# EAGLE design AS3364 DG412 bus mixer v1.1 (EAGLE 9.6.2)
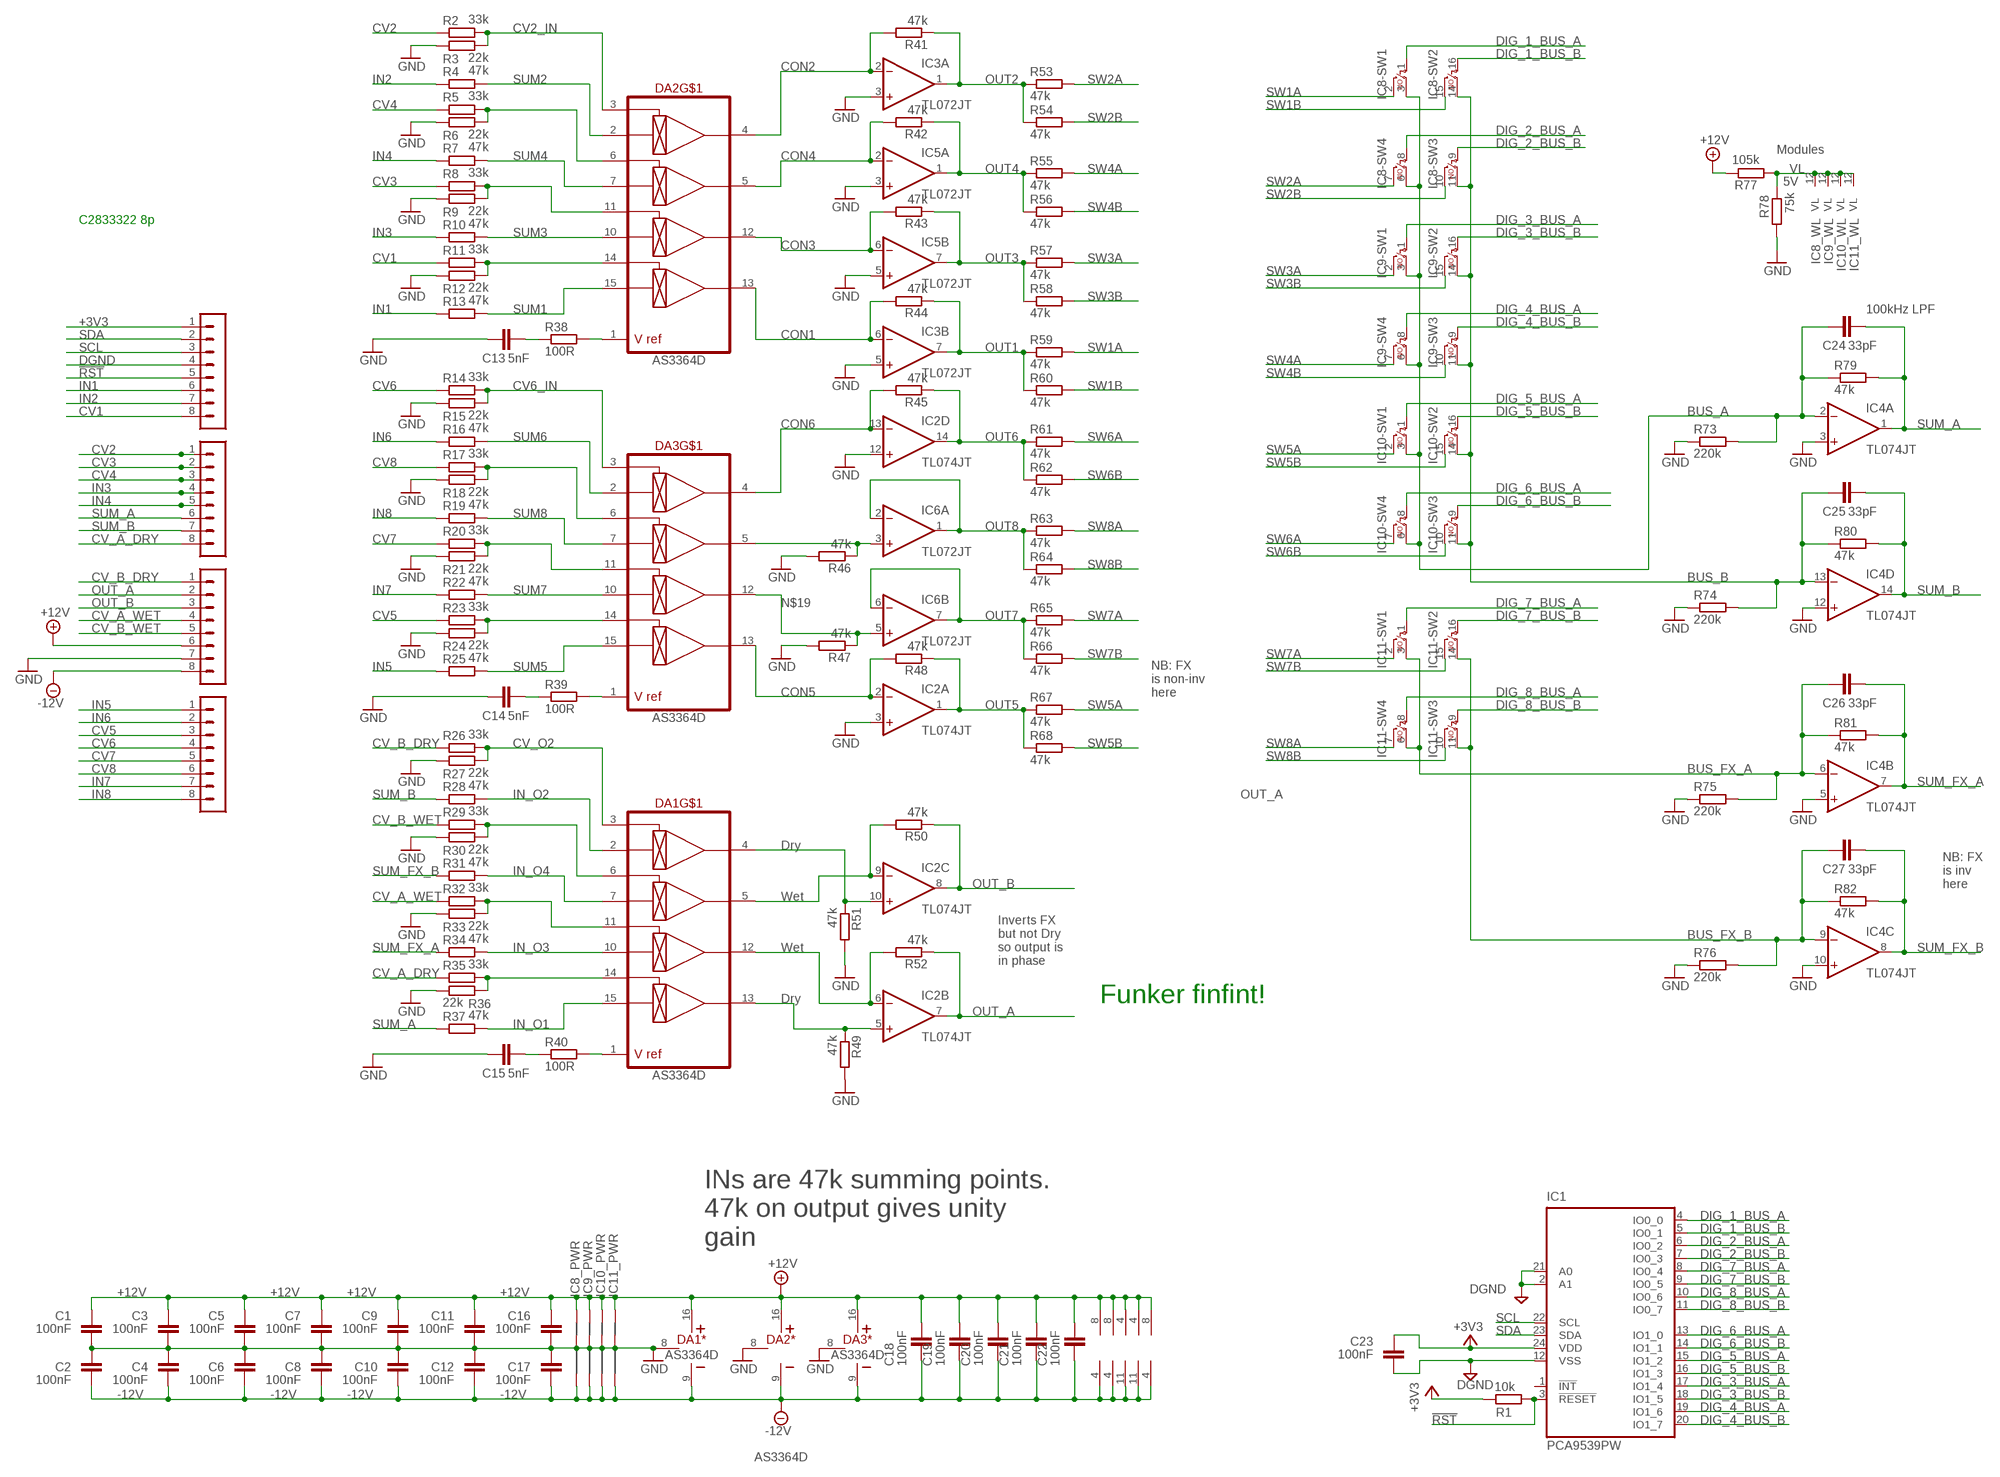
[diagram p0: schematic, sheet 1]

## Parts
C1  100nF  C-EUC0402  [C0402]
C2  100nF  C-EUC0402  [C0402]
C3  100nF  C-EUC0402  [C0402]
C4  100nF  C-EUC0402  [C0402]
C5  100nF  C-EUC0402  [C0402]
C6  100nF  C-EUC0402  [C0402]
C7  100nF  C-EUC0402  [C0402]
C8  100nF  C-EUC0402  [C0402]
C9  100nF  C-EUC0402  [C0402]
C10  100nF  C-EUC0402  [C0402]
C11  100nF  C-EUC0402  [C0402]
C12  100nF  C-EUC0402  [C0402]
C13  5nF  C-EU-J  [C0402-J]
C14  5nF  C-EU-J  [C0402-J]
C15  5nF  C-EU-J  [C0402-J]
C16  100nF  C-EUC0402  [C0402]
C17  100nF  C-EUC0402  [C0402]
C18  100nF  C-EUC0402  [C0402]
C19  100nF  C-EUC0402  [C0402]
C20  100nF  C-EUC0402  [C0402]
C21  100nF  C-EUC0402  [C0402]
C22  100nF  C-EUC0402  [C0402]
C23  100nF  C-EUC0402  [C0402]
C24  33pF  C-EU-J  [C0402-J]
C25  33pF  C-EU-J  [C0402-J]
C26  33pF  C-EU-J  [C0402-J]
C27  33pF  C-EU-J  [C0402-J]
DA1  AS3364D  [DIL16J]
DA2  AS3364D  [DIL16J]
DA3  AS3364D  [DIL16J]
IC1  PCA9539PW  [TSSOP24J]
IC2  TL074JT  [TSSOP14J]
IC3  TL072JT  [TSSOP8J]
IC4  TL074JT  [TSSOP14J]
IC5  TL072JT  [TSSOP8J]
IC6  TL072JT  [TSSOP8J]
IC8  DG412-J  [DIL16J]
IC9  DG412-J  [DIL16J]
IC10  DG412-J  [DIL16J]
IC11  DG412-J  [DIL16J]
R1  10k  R-EU_R0402  [R0402]
R2  33k  R-EU_R0402  [R0402]
R3  22k  R-EU_R0402  [R0402]
R4  47k  R-EU_R0402  [R0402]
R5  33k  R-EU_R0402  [R0402]
R6  22k  R-EU_R0402  [R0402]
R7  47k  R-EU_R0402  [R0402]
R8  33k  R-EU_R0402  [R0402]
R9  22k  R-EU_R0402  [R0402]
R10  47k  R-EU_R0402  [R0402]
R11  33k  R-EU_R0402  [R0402]
R12  22k  R-EU_R0402  [R0402]
R13  47k  R-EU_R0402  [R0402]
R14  33k  R-EU_R0402  [R0402]
R15  22k  R-EU_R0402  [R0402]
R16  47k  R-EU_R0402  [R0402]
R17  33k  R-EU_R0402  [R0402]
R18  22k  R-EU_R0402  [R0402]
R19  47k  R-EU_R0402  [R0402]
R20  33k  R-EU_R0402  [R0402]
R21  22k  R-EU_R0402  [R0402]
R22  47k  R-EU_R0402  [R0402]
R23  33k  R-EU_R0402  [R0402]
R24  22k  R-EU_R0402  [R0402]
R25  47k  R-EU_R0402  [R0402]
R26  33k  R-EU_R0402  [R0402]
R27  22k  R-EU_R0402  [R0402]
R28  47k  R-EU_R0402  [R0402]
R29  33k  R-EU_R0402  [R0402]
R30  22k  R-EU_R0402  [R0402]
R31  47k  R-EU_R0402  [R0402]
R32  33k  R-EU_R0402  [R0402]
R33  22k  R-EU_R0402  [R0402]
R34  47k  R-EU_R0402  [R0402]
R35  33k  R-EU_R0402  [R0402]
R36  22k  R-EU_R0402  [R0402]
R37  47k  R-EU_R0402  [R0402]
R38  100R  R-EU_R0402  [R0402]
R39  100R  R-EU_R0402  [R0402]
R40  100R  R-EU_R0402  [R0402]
R41  47k  R-EU_R0402  [R0402]
R42  47k  R-EU_R0402  [R0402]
R43  47k  R-EU_R0402  [R0402]
R44  47k  R-EU_R0402  [R0402]
R45  47k  R-EU_R0402  [R0402]
R46  47k  R-EU_R0402  [R0402]
R47  47k  R-EU_R0402  [R0402]
R48  47k  R-EU_R0402  [R0402]
R49  47k  R-EU_R0402  [R0402]
R50  47k  R-EU_R0402  [R0402]
R51  47k  R-EU_R0402  [R0402]
R52  47k  R-EU_R0402  [R0402]
R53  47k  R-EU_R0402  [R0402]
R54  47k  R-EU_R0402  [R0402]
R55  47k  R-EU_R0402  [R0402]
R56  47k  R-EU_R0402  [R0402]
R57  47k  R-EU_R0402  [R0402]
R58  47k  R-EU_R0402  [R0402]
R59  47k  R-EU_R0402  [R0402]
R60  47k  R-EU_R0402  [R0402]
R61  47k  R-EU_R0402  [R0402]
R62  47k  R-EU_R0402  [R0402]
R63  47k  R-EU_R0402  [R0402]
R64  47k  R-EU_R0402  [R0402]
R65  47k  R-EU_R0402  [R0402]
R66  47k  R-EU_R0402  [R0402]
R67  47k  R-EU_R0402  [R0402]
R68  47k  R-EU_R0402  [R0402]
R73  220k  R-EU_R0402  [R0402]
R74  220k  R-EU_R0402  [R0402]
R75  220k  R-EU_R0402  [R0402]
R76  220k  R-EU_R0402  [R0402]
R77  105k  R-EU_R0402  [R0402]
R78  75k  R-EU_R0402  [R0402]
R79  47k  R-EU_R0402  [R0402]
R80  47k  R-EU_R0402  [R0402]
R81  47k  R-EU_R0402  [R0402]
R82  47k  R-EU_R0402  [R0402]
SV1  MA08-1JP  [SIP-PIN08-1J]
SV3  MA08-1JP  [SIP-PIN08-1J]
SV4  MA08-1JP  [SIP-PIN08-1J]
SV33  MA08-1JP  [SIP-PIN08-1J]

## Nets
!RST: IC1.3(!RESET) R1.2 SV33.5
+3V3: C23.2 IC1.24(VDD) R1.1 SV33.1
+12V: C1.2 C3.2 C5.2 C7.2 C9.2 C11.2 C16.2 C18.2 C19.2 C20.2 C21.2 C22.2 DA1.16(*:V+) DA2.16(*:V+) DA3.16(*:V+) IC2.4(P:V+) IC3.8(P:V+) IC4.4(P:V+) IC5.8(P:V+) IC6.8(P:V+) IC8.13(_PWR:+15V) IC9.13(_PWR:+15V) IC10.13(_PWR:+15V) IC11.13(_PWR:+15V) R77.1 SV4.6
-12V: C2.1 C4.1 C6.1 C8.1 C10.1 C12.1 C17.1 C18.1 C19.1 C20.1 C21.1 C22.1 DA1.9(*:V-) DA2.9(*:V-) DA3.9(*:V-) IC2.11(P:V-) IC3.4(P:V-) IC4.11(P:V-) IC5.4(P:V-) IC6.4(P:V-) IC8.4(_PWR:-15V) IC9.4(_PWR:-15V) IC10.4(_PWR:-15V) IC11.4(_PWR:-15V) SV4.8
BUS_A: C24.1 IC4.2(A:-IN) IC8.3(-SW1:S) IC8.6(-SW4:S) IC9.3(-SW1:S) IC9.6(-SW4:S) IC10.3(-SW1:S) IC10.6(-SW4:S) R73.2 R79.1
BUS_B: C25.1 IC4.13(D:-IN) IC8.11(-SW3:S) IC8.14(-SW2:S) IC9.11(-SW3:S) IC9.14(-SW2:S) IC10.11(-SW3:S) IC10.14(-SW2:S) R74.2 R80.1
BUS_FX_A: C26.1 IC4.6(B:-IN) IC11.3(-SW1:S) IC11.6(-SW4:S) R75.2 R81.1
BUS_FX_B: C27.1 IC4.9(C:-IN) IC11.11(-SW3:S) IC11.14(-SW2:S) R76.2 R82.1
CON1: DA2.13(OUT4) IC3.6(B:-IN) R44.2
CON2: DA2.4(OUT1) IC3.2(A:-IN) R41.2
CON3: DA2.12(OUT3) IC5.6(B:-IN) R43.2
CON4: DA2.5(OUT2) IC5.2(A:-IN) R42.2
CON5: DA3.13(OUT4) IC2.2(A:-IN) R48.2
CON6: DA3.4(OUT1) IC2.13(D:-IN) R45.2
CON_O1: DA1.12(OUT3) IC2.6(B:-IN) R52.2
CV1: R11.1 SV33.8
CV2: R2.1 SV1.1
CV2_IN: DA2.3(CV1) R2.2 R3.2
CV3: R8.1 SV1.2
CV4: R5.1 SV1.3
CV5: R23.1 SV3.3
CV6: R14.1 SV3.4
CV6_IN: DA3.3(CV1) R14.2 R15.2
CV7: R20.1 SV3.5
CV8: R17.1 SV3.6
CV_A_DRY: R35.1 SV1.8
CV_A_WET: R32.1 SV4.4
CV_B_DRY: R26.1 SV4.1
CV_B_WET: R29.1 SV4.5
CV_O2: DA1.3(CV1) R26.2 R27.2
DGND: C23.1 IC1.2(A1) IC1.12(VSS) IC1.21(A0) SV33.4
DIG_1_BUS_A: IC1.4(IO0_0) IC8.1(-SW1:C)
DIG_1_BUS_B: IC1.5(IO0_1) IC8.16(-SW2:C)
DIG_2_BUS_A: IC1.6(IO0_2) IC8.8(-SW4:C)
DIG_2_BUS_B: IC1.7(IO0_3) IC8.9(-SW3:C)
DIG_3_BUS_A: IC1.17(IO1_4) IC9.1(-SW1:C)
DIG_3_BUS_B: IC1.18(IO1_5) IC9.16(-SW2:C)
DIG_4_BUS_A: IC1.19(IO1_6) IC9.8(-SW4:C)
DIG_4_BUS_B: IC1.20(IO1_7) IC9.9(-SW3:C)
DIG_5_BUS_A: IC1.15(IO1_2) IC10.1(-SW1:C)
DIG_5_BUS_B: IC1.16(IO1_3) IC10.16(-SW2:C)
DIG_6_BUS_A: IC1.13(IO1_0) IC10.8(-SW4:C)
DIG_6_BUS_B: IC1.14(IO1_1) IC10.9(-SW3:C)
DIG_7_BUS_A: IC1.8(IO0_4) IC11.1(-SW1:C)
DIG_7_BUS_B: IC1.9(IO0_5) IC11.16(-SW2:C)
DIG_8_BUS_A: IC1.10(IO0_6) IC11.8(-SW4:C)
DIG_8_BUS_B: IC1.11(IO0_7) IC11.9(-SW3:C)
GND: C1.1 C2.2 C3.1 C4.2 C5.1 C6.2 C7.1 C8.2 C9.1 C10.2 C11.1 C12.2 C13.1 C14.1 C15.1 C16.1 C17.2 DA1.8(*:GND) DA2.8(*:GND) DA3.8(*:GND) IC2.3(A:+IN) IC2.12(D:+IN) IC3.3(A:+IN) IC3.5(B:+IN) IC4.3(A:+IN) IC4.5(B:+IN) IC4.10(C:+IN) IC4.12(D:+IN) IC5.3(A:+IN) IC5.5(B:+IN) IC8.5(_PWR:AGND) IC9.5(_PWR:AGND) IC10.5(_PWR:AGND) IC11.5(_PWR:AGND) R3.1 R6.1 R9.1 R12.1 R15.1 R18.1 R21.1 R24.1 R27.1 R30.1 R33.1 R36.1 R46.2 R47.2 R49.2 R51.2 R73.1 R74.1 R75.1 R76.1 R78.2 SV4.7
IN1: R13.1 SV33.6
IN2: R4.1 SV33.7
IN3: R10.1 SV1.4
IN4: R7.1 SV1.5
IN5: R25.1 SV3.1
IN6: R16.1 SV3.2
IN7: R22.1 SV3.7
IN8: R19.1 SV3.8
IN_O1: DA1.15(IN4) R37.2
IN_O2: DA1.2(IN1) R28.2
IN_O3: DA1.10(IN3) R34.2
IN_O4: DA1.7(IN2) R31.2
N$1: DA3.1(VREF) R39.2
N$2: DA2.1(VREF) R38.2
N$3: DA3.6(CV2) R17.2 R18.2
N$4: DA3.5(OUT2) IC6.3(A:+IN) R46.1
N$5: DA3.11(CV3) R20.2 R21.2
N$6: DA1.5(OUT2) IC2.9(C:-IN) R50.2
N$7: DA3.14(CV4) R23.2 R24.2
N$8: C14.2 R39.1
N$9: DA1.1(VREF) R40.2
N$10: DA2.6(CV2) R5.2 R6.2
N$11: DA1.6(CV2) R29.2 R30.2
N$12: DA2.11(CV3) R8.2 R9.2
N$13: DA1.11(CV3) R32.2 R33.2
N$14: C13.2 R38.1
N$15: DA1.14(CV4) R35.2 R36.2
N$16: C15.2 R40.1
N$17: DA1.4(OUT1) IC2.10(C:+IN) R51.1
N$18: DA1.13(OUT4) IC2.5(B:+IN) R49.1
N$19: DA3.12(OUT3) IC6.5(B:+IN) R47.1
N$21: DA2.14(CV4) R11.2 R12.2
OUT1: IC3.7(B:OUT) R44.1 R59.1 R60.1
OUT2: IC3.1(A:OUT) R41.1 R53.1 R54.1
OUT3: IC5.7(B:OUT) R43.1 R57.1 R58.1
OUT4: IC5.1(A:OUT) R42.1 R55.1 R56.1
OUT5: IC2.1(A:OUT) R48.1 R67.1 R68.1
OUT6: IC2.14(D:OUT) R45.1 R61.1 R62.1
OUT7: IC6.6(B:-IN) IC6.7(B:OUT) R65.1 R66.1
OUT8: IC6.1(A:OUT) IC6.2(A:-IN) R63.1 R64.1
OUT_A: IC2.7(B:OUT) R52.1 SV4.2
OUT_B: IC2.8(C:OUT) R50.1 SV4.3
SCL: IC1.22(SCL) SV33.3
SDA: IC1.23(SDA) SV33.2
SUM1: DA2.15(IN4) R13.2
SUM2: DA2.2(IN1) R4.2
SUM3: DA2.10(IN3) R10.2
SUM4: DA2.7(IN2) R7.2
SUM5: DA3.15(IN4) R25.2
SUM6: DA3.2(IN1) R16.2
SUM7: DA3.10(IN3) R22.2
SUM8: DA3.7(IN2) R19.2
SUM_A: C24.2 IC4.1(A:OUT) R37.1 R79.2 SV1.6
SUM_B: C25.2 IC4.14(D:OUT) R28.1 R80.2 SV1.7
SUM_FX_A: C26.2 IC4.7(B:OUT) R34.1 R81.2
SUM_FX_B: C27.2 IC4.8(C:OUT) R31.1 R82.2
SW1A: IC8.2(-SW1:D) R59.2
SW1B: IC8.15(-SW2:D) R60.2
SW2A: IC8.7(-SW4:D) R53.2
SW2B: IC8.10(-SW3:D) R54.2
SW3A: IC9.2(-SW1:D) R57.2
SW3B: IC9.15(-SW2:D) R58.2
SW4A: IC9.7(-SW4:D) R55.2
SW4B: IC9.10(-SW3:D) R56.2
SW5A: IC10.2(-SW1:D) R67.2
SW5B: IC10.15(-SW2:D) R68.2
SW6A: IC10.7(-SW4:D) R61.2
SW6B: IC10.10(-SW3:D) R62.2
SW7A: IC11.2(-SW1:D) R65.2
SW7B: IC11.15(-SW2:D) R66.2
SW8A: IC11.7(-SW4:D) R63.2
SW8B: IC11.10(-SW3:D) R64.2
VL: IC8.12(_WL:VL) IC9.12(_WL:VL) IC10.12(_WL:VL) IC11.12(_WL:VL) R77.2 R78.1
Unconnected: IC1.1(!INT)

## Notes on the sheet
- Modules
- 5V
- C2833322 8p
- 100kHz LPF
- NB: FX
  is non-inv
  here
- Dry
- NB: FX
  is inv
  here
- Wet
- Wet
- Inverts FX
  but not Dry
  so output is
  in phase
- Dry | Funker finfint!
- INs are 47k summing points.
  47k on output gives unity
  gain

## Library data of the parts
C1-C12 C16-C23 = rcl:C-EU: CAPACITOR, European symbol; SPICEPREFIX: C
C13-C15 C24-C27 = joakim:C-EU-J: CAPACITOR, European symbol
DA1-DA3 = joakim:AS3364: AS3364 quad linear VCA, CEM3360 style. CV is 0 to 2V Vcc-Vee = 26V max, so +/-12V or +15V/-9V
IC1 = joakim:PCA9539: 16ch i/o expander. RPW version resets only internal statemachine to get out of stuck i2c-bus, other versions also reset outputs. Interrupt output requires external pull-up resistor for all variants. https://www.nxp.com/docs/en/data-sheet/PCA9539_PCA9539R.pdf
IC2 IC4 = joakim:TL074J: OP AMP
IC3 IC5 IC6 = joakim:TL072J: OP AMP
IC8-IC11 = joakim:DG412-J: Quad switch, normally open
R1-R68 R73-R82 = rcl:R-EU_: RESISTOR, European symbol; SPICEPREFIX: R
SV1 SV3 SV4 SV33 = joakim:MA08-1J: PIN HEADER

## Board
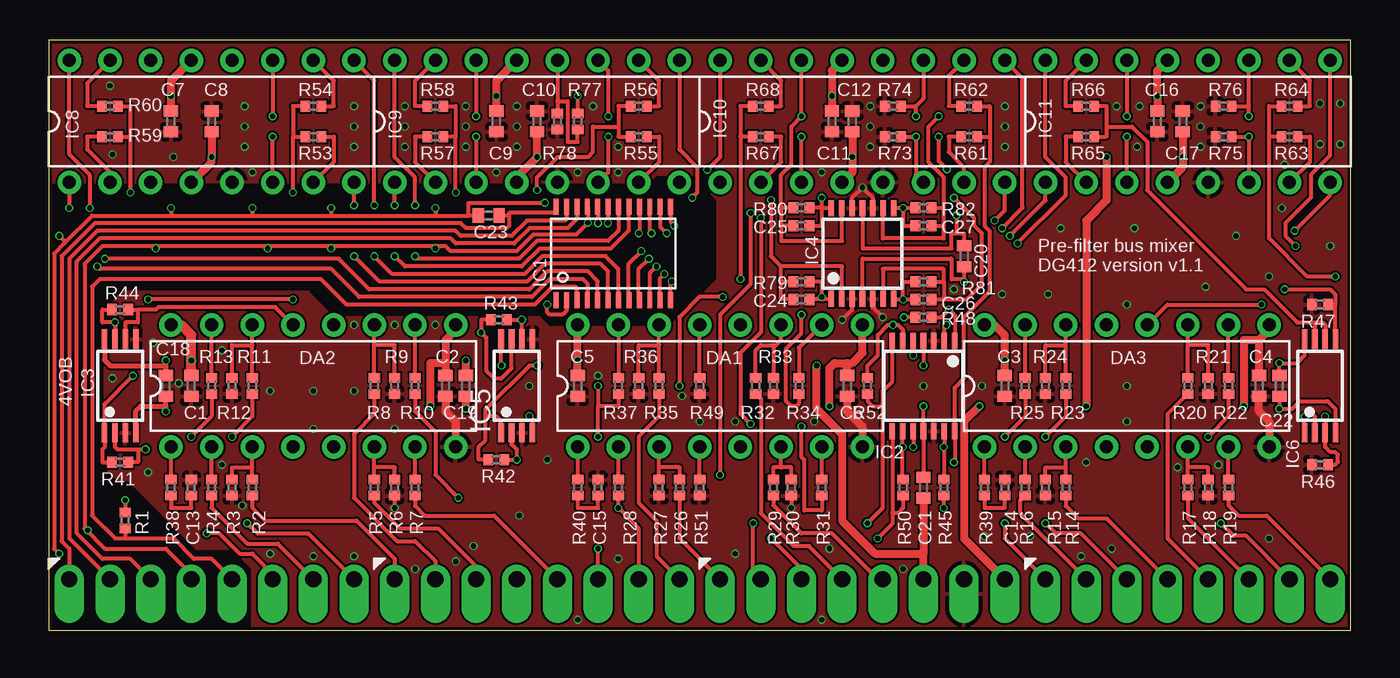
[diagram p1: board, top side]
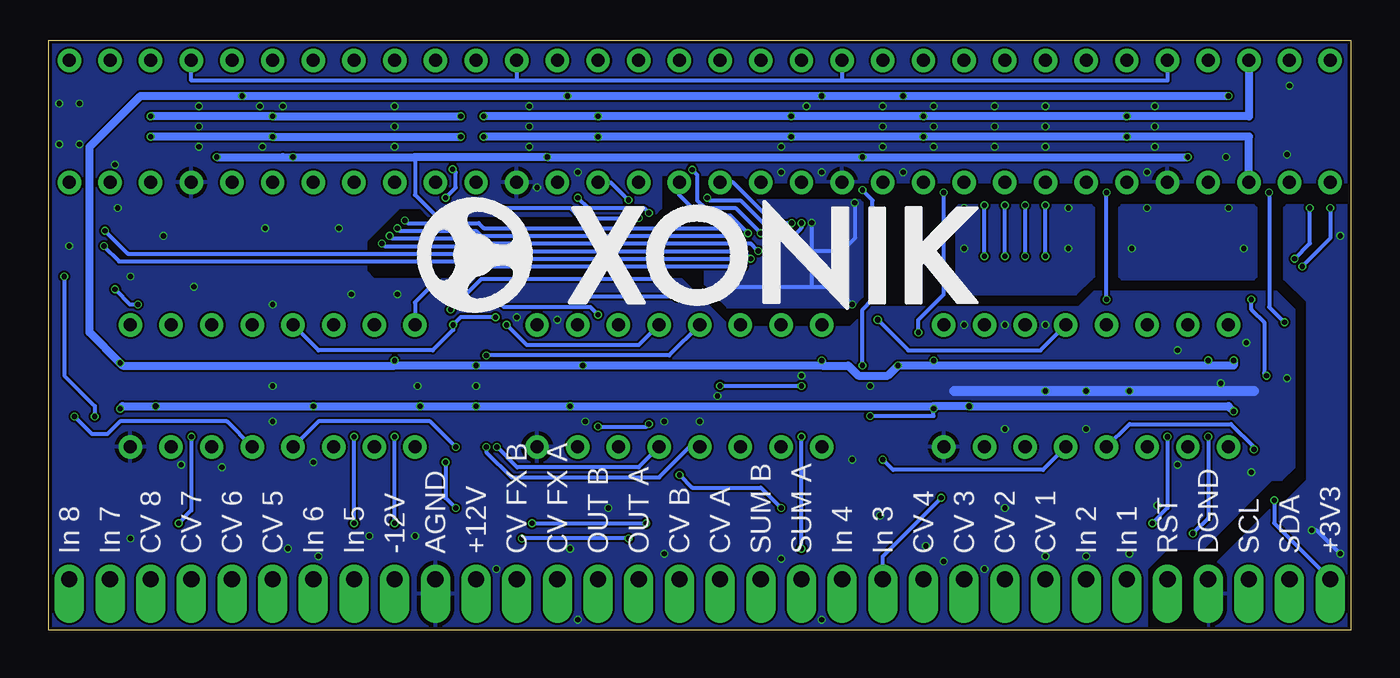
[diagram p2: board, bottom side, seen from below]

Size 81.28 x 36.83 mm. Coordinates in mm from the lower left corner, seen from the top.
Outline: 0,0 81.28,0 81.28,36.83 0,36.83 0,0
Copper layers (1*16): Top 0.035mm / dielectric 1.6mm / Bottom 0.035mm
Design rules "jlcpcb-2layers": minimum track width 5mil, minimum drill 0.3mm, track to track 5mil, track to pad 5mil, pad to pad 5mil, via to via 5mil, smd to smd 5mil, copper to edge 0.2mm, drill to drill 6mil, minimum pad ring 10mil, minimum via ring 3mil, stop-mask expansion 4mil, vias tented up to drill 0mil, thermal gap 10mil

### Footprints (pad centres in the part's own frame; a part is rotated, then mirrored left to right if it is on the bottom)
C0402 = smd 0.7 x 0.9: 1 -0.65,0; 2 0.65,0
C0402-J = smd 0.6 x 0.7: 1 -0.5,0; 2 0.5,0
DIL16J = drill 0.813: 1 -8.89,-3.81; 2 -6.35,-3.81; 3 -3.81,-3.81; 4 -1.27,-3.81; 5 1.27,-3.81; 6 3.81,-3.81; 7 6.35,-3.81; 8 8.89,-3.81; 9 8.89,3.81; 10 6.35,3.81; 11 3.81,3.81; 12 1.27,3.81; 13 -1.27,3.81; 14 -3.81,3.81; 15 -6.35,3.81; 16 -8.89,3.81
TSSOP24J = smd 0.305 x 0.991: 1 -3.575,-2.918; 2 -2.925,-2.918; 3 -2.275,-2.918; 4 -1.625,-2.918; 5 -0.975,-2.918; 6 -0.325,-2.918; 7 0.325,-2.918; 8 0.975,-2.918; 9 1.625,-2.918; 10 2.275,-2.918; 11 2.925,-2.918; 12 3.575,-2.918; 13 3.575,2.918; 14 2.925,2.918; 15 2.275,2.918; 16 1.625,2.918; 17 0.975,2.918; 18 0.325,2.918; 19 -0.325,2.918; 20 -0.975,2.918; 21 -1.625,2.918; 22 -2.275,2.918; 23 -2.925,2.918; 24 -3.575,2.918
TSSOP14J = smd 0.35 x 1: 1 -1.95,-2.825; 2 -1.3,-2.825; 3 -0.65,-2.825; 4 0,-2.825; 5 0.65,-2.825; 6 1.3,-2.825; 7 1.95,-2.825; 8 1.95,2.825; 9 1.3,2.825; 10 0.65,2.825; 11 0,2.825; 12 -0.65,2.825; 13 -1.3,2.825; 14 -1.95,2.825
TSSOP8J = smd 1.2 x 0.35: 1 -2.925,0.975; 2 -2.925,0.325; 3 -2.925,-0.325; 4 -2.925,-0.975; 5 2.925,-0.975; 6 2.925,-0.325; 7 2.925,0.325; 8 2.925,0.975
R0402 = smd 0.6 x 0.7: 1 -0.5,0; 2 0.5,0
SIP-PIN08-1J = drill 1.016 offset: 1 -8.89,0; 2 -6.35,0; 3 -3.81,0; 4 -1.27,0; 5 1.27,0; 6 3.81,0; 7 6.35,0; 8 8.89,0

### Placement (x,y rotation side)
C1  8.89,15.24 90 top
C2  24.77,15.24 270 top
C3  59.69,15.24 90 top
C4  75.56,15.24 270 top
C5  33.02,15.24 90 top
C6  49.85,15.24 270 top
C7  7.62,31.75 90 top
C8  10.16,31.75 90 top
C9  27.94,31.75 90 top
C10  30.48,31.75 90 top
C11  48.9,31.75 90 top
C12  50.16,31.75 90 top
C13  8.89,8.89 270 top
C14  59.69,8.89 270 top
C15  34.29,8.89 270 top
C16  69.22,31.75 90 top
C17  70.8,31.75 90 top
C18  7.3,15.24 90 top
C19  26.04,15.24 90 top
C20  57.15,23.34 270 top
C21  54.61,8.89 270 top
C22  76.83,15.24 90 top
C23  27.46,25.88 0 top
C24  46.99,21.75 0 top
C25  46.99,25.24 0 top
C26  54.61,21.75 180 top
C27  54.61,25.24 180 top
DA1  41.91,15.24 0 top
DA2  16.51,15.24 0 top
DA3  67.31,15.24 0 top
IC1  35.24,23.5 0 top
IC2  54.61,15.24 180 top
IC3  4.45,15.24 90 top
IC4  50.8,23.5 0 top
IC5  29.21,15.24 90 top
IC6  79.38,15.24 90 top
IC8  10.16,31.75 0 top
IC9  30.48,31.75 0 top
IC10  50.8,31.75 0 top
IC11  71.12,31.75 0 top
R1  4.76,6.83 270 top
R2  12.7,8.89 90 top
R3  11.43,8.89 90 top
R4  10.16,8.89 90 top
R5  20.32,8.89 90 top
R6  21.59,8.89 90 top
R7  22.86,8.89 90 top
R8  20.32,15.24 90 top
R9  21.59,15.24 90 top
R10  22.86,15.24 90 top
R11  12.7,15.24 90 top
R12  11.43,15.24 90 top
R13  10.16,15.24 90 top
R14  63.5,8.89 90 top
R15  62.23,8.89 90 top
R16  60.96,8.89 90 top
R17  71.12,8.89 90 top
R18  72.39,8.89 90 top
R19  73.66,8.89 90 top
R20  71.12,15.24 90 top
R21  72.39,15.24 90 top
R22  73.66,15.24 90 top
R23  63.5,15.24 90 top
R24  62.23,15.24 90 top
R25  60.96,15.24 90 top
R26  39.37,8.89 90 top
R27  38.1,8.89 90 top
R28  35.56,8.89 90 top
R29  45.24,8.89 90 top
R30  46.35,8.89 90 top
R31  48.26,8.89 90 top
R32  44.13,15.24 90 top
R33  45.24,15.24 90 top
R34  46.83,15.24 90 top
R35  38.1,15.24 90 top
R36  36.83,15.24 90 top
R37  35.56,15.24 90 top
R38  7.62,8.89 90 top
R39  58.42,8.89 90 top
R40  33.02,8.89 90 top
R41  4.45,10.48 0 top
R42  27.94,10.64 0 top
R43  28.1,19.37 0 top
R44  4.45,20 0 top
R45  55.88,8.89 90 top
R46  79.38,10.32 180 top
R47  79.38,20.32 180 top
R48  54.61,19.53 180 top
R49  40.64,15.24 270 top
R50  53.34,8.89 90 top
R51  40.64,8.89 270 top
R52  51.12,15.24 90 top
R53  16.51,30.8 0 top
R54  16.51,32.7 0 top
R55  36.83,30.8 0 top
R56  36.83,32.7 0 top
R57  24.13,30.8 180 top
R58  24.13,32.7 180 top
R59  3.81,30.8 180 top
R60  3.81,32.7 180 top
R61  57.47,30.8 180 top
R62  57.47,32.7 180 top
R63  77.47,30.8 0 top
R64  77.47,32.7 0 top
R65  64.77,30.8 180 top
R66  64.77,32.7 180 top
R67  44.45,30.8 0 top
R68  44.45,32.7 0 top
R73  52.7,30.8 0 top
R74  52.7,32.7 0 top
R75  73.34,30.8 0 top
R76  73.34,32.7 0 top
R77  47k  [R0402]  33.02,31.75 270 top
R78  33k  [R0402]  31.75,31.75 270 top
R79  46.99,20.64 0 top
R80  46.99,26.35 0 top
R81  54.61,20.64 180 top
R82  54.61,26.35 180 top
SV1  30.48,3.17 0 top
SV3  71.12,3.17 0 top
SV4  50.8,3.17 0 top
SV33  10.16,3.17 0 top
U$1  [XONIK_LOGO_35]  58.26,19.84 0 bottom

### Tracks (layer width: path | path; a pad name or v marks a point on that pad's centre or on a via)
!RST
  Top 0.254: IC1.3 32.97,21.32 32.86,21.43 31.43,21.43 30.32,20.32 18.57,20.32 16.99,21.91 3.17,21.91 2.7,21.43 2.7,7.14 4.13,5.71 4.76,5.71 | SV33.5 10.16,4.45 9.05,4.45 7.78,5.71 4.76,5.71 | R1.2 4.76,5.71
+3V3  (via drill 0.33)
  Top 0.254: IC1.24 31.67,26.09 31.61,26.04 28.73,26.04 28.73,25.88 | 28.73,25.88 C23.2 | 28.73,25.88 28.73,25.24 28.57,25.08 26.04,25.08 25.72,25.4 2.86,25.4 0.79,23.34 0.79,5.56 1.27,5.08 SV33.1 | v4.76,8.1 R1.1
  Bottom 0.254: v4.76,8.1 4.76,6.67 SV33.1
+12V  (via drill 0.33, 0.35)
  Top 0.254: v33.02,33.34 R77.1 | IC4.4 50.8,23.18 56.34,23.18 56.36,23.16 56.36,21.89 56.99,21.89 v57.15,21.73 C20.2 | C22.2 v76.83,16.67 77.95,16.67 78.42,17.14 78.42,18.14 IC6.8 | IC2.4 v54.61,16.51 | C20.2 | IC5.8 28.23,16.53 v28.26,16.51
  Top 0.305: IC3.8 3.47,16.85 3.81,16.51 7.3,16.51 | 7.3,16.51 C18.2 | 7.3,16.51 v7.3,16.83
  Top 0.508: C3.2 v59.69,16.83 59.69,18.41 59.05,19.05 DA3.16 | C5.2 v33.02,16.83 DA1.16 | C7.2 v7.62,33.34 7.62,34.29 IC8.13 | C9.2 v27.94,33.34 27.94,34.29 IC9.13 | C11.2 v48.9,33.34 48.9,34.92 IC10.13 | C16.2 v69.22,33.34 69.22,34.92 IC11.13 | C19.2 v26.04,16.83 | SV4.6 54.61,4.76 | v47.94,16.51 47.94,13.81 49.53,12.22 49.53,6.83 51.59,4.76 54.61,4.76 | C21.2 54.61,4.76
  Top 0.61: C1.2 v8.89,16.83 8.89,18.41 8.26,19.05 DA2.16
  Bottom 0.254: v57.15,21.73 58.42,20.46 DA3.16
  Bottom 0.508: 33.02,16.51 v47.94,16.51 v54.61,16.51 59.69,16.51 | v7.3,16.83 7.3,16.51 8.89,16.51 | v7.62,33.34 v27.94,33.34 v33.02,33.34 v48.9,33.34 v69.22,33.34 75.56,33.34 78.74,30.16 78.74,18.57 v76.83,16.67 76.68,16.51 59.69,16.51 | v33.02,16.83 33.02,16.51 | v59.69,16.83 59.69,16.51 | 8.89,16.51 26.04,16.51 | 26.04,16.51 v28.26,16.51 28.89,15.88 28.91,15.89 30.74,15.89 31.36,16.51 33.02,16.51 | v8.89,16.83 8.89,16.51 | v26.04,16.83 26.04,16.51
-12V  (via drill 0.33, 0.35)
  Top 0.254: v54.61,13.97 IC2.11 C21.1 | IC4.11 50.8,23.81 56.36,23.81 56.36,24.77 56.67,24.77 | C22.1 v76.83,13.81 77.63,13.81 78.11,14.29 79.85,14.29 80.35,13.79 IC6.4 | 56.67,24.77 57.15,24.77 C20.1 | v56.67,25.89 56.67,24.77 | IC5.4 30.18,13.19 v30,13.37
  Top 0.305: IC3.4 5.42,13.68 5.71,13.97 7.3,13.97 | 7.3,13.97 C18.1 | 7.3,13.97 v7.3,13.65
  Top 0.508: DA2.9 25.4,18.73 24.77,18.1 24.77,16.67 | 24.77,16.67 C2.1 | 24.77,16.67 23.81,16.67 v23.81,13.97 | DA3.9 76.2,18.73 75.56,18.1 | 75.56,18.1 C4.1 | 75.56,18.1 74.61,18.1 v74.61,13.97 | C6.1 49.85,16.67 | C8.1 v10.16,29.53 10.16,29.21 IC8.4 | IC9.4 29.21,28.26 v30.48,29.53 C10.1 | C12.1 v50.16,29.53 50.16,28.57 IC10.4 | C17.1 v70.8,29.53 70.8,28.89 IC11.4 | v66.04,29.53 66.04,26.83 64.77,25.56 v64.77,13.97 | SV4.8 57.15,5.71 57.15,13.02 v58.1,13.97 | 49.85,16.67 50.16,16.67 50.8,17.3 DA1.9 | v26.04,13.81 C19.1 | v48.74,13.97 48.74,16.35 49.05,16.67 49.85,16.67
  Bottom 0.254: v56.67,25.89 57.15,25.89 58.42,27.16 58.42,29.53 | v66.04,29.53 66.67,29.53 | v30,13.37 26.04,13.37 26.04,13.97
  Bottom 0.508: v7.3,13.65 7.62,13.97 v23.81,13.97 26.04,13.97 | 26.04,13.97 v48.74,13.97 v54.61,13.97 v58.1,13.97 v64.77,13.97 v74.61,13.97 76.68,13.97 v76.83,13.81 | v10.16,29.53 v30.48,29.53 v50.16,29.53 58.42,29.53 66.67,29.53 v70.8,29.53 | 26.04,13.97 v26.04,13.81
BUS_A  (via drill 0.33)
  Top 0.254: v26.67,30.8 IC9.3 | v34.92,30.8 34.92,28.57 IC9.6 | IC8.6 v13.97,30.8 | IC10.3 v46.99,30.8 | IC10.6 54.13,28.42 v54.13,30.8 R73.2 | IC4.2 49.53,20.7 49.53,22.7 45.72,22.7 | v45.09,26.85 45.09,23.34 45.72,22.7 | R79.1 45.72,20.64 45.72,21.75 | 45.72,21.75 45.72,22.7 | C24.1 45.72,21.75
  Bottom 0.254: IC10.3 46.2,27.94 45.1,26.85 v45.09,26.85
  Bottom 0.508: IC8.3 6.35,30.8 v13.97,30.8 v26.67,30.8 v34.92,30.8 v46.99,30.8 v54.13,30.8
BUS_B  (via drill 0.33)
  Top 0.254: IC8.11 v13.97,32.07 | IC9.14 v26.67,32.07 | IC9.11 34.92,34.92 v34.92,32.07 | IC10.14 v46.99,32.07 46.35,31.43 46.35,29.05 45.72,28.42 45.72,26.35 | v54.13,32.07 54.13,32.7 | R74.2 54.13,32.7 | 45.72,26.35 45.72,25.24 | 45.72,25.24 45.72,24.29 49.53,24.29 49.53,26.29 IC4.13 | R80.1 45.72,26.35 | IC10.11 54.61,33.18 54.13,32.7 | C25.1 45.72,25.24
  Bottom 0.508: IC8.14 6.35,32.07 v13.97,32.07 v26.67,32.07 v34.92,32.07 v46.99,32.07 v54.13,32.07
BUS_FX_A  (via drill 0.33)
  Top 0.254: IC11.3 v67.31,30.8 | IC11.6 v74.93,30.8 R75.2 | R81.1 55.88,20.64 | IC4.6 52.07,20.7 52.07,22.54 55.88,22.54 55.88,21.75 | v56.07,28.77 55.56,29.27 v55.56,30.8 | 55.88,21.75 55.88,20.64 | v56.52,26.99 57.78,25.72 57.78,25.24 58.26,24.77 58.26,21.59 57.31,20.64 55.88,20.64 | C26.1 55.88,21.75
  Bottom 0.254: v56.07,28.77 55.88,28.57 55.88,27.62 v56.52,26.99
  Bottom 0.508: v74.93,30.8 v67.31,30.8 v55.56,30.8
BUS_FX_B  (via drill 0.33)
  Top 0.254: IC11.14 v67.31,32.07 | v74.93,32.07 74.93,32.7 | 74.93,32.7 IC11.11 | R76.2 74.93,32.7 | R82.1 55.88,26.35 | 55.88,25.24 55.88,24.45 52.07,24.45 52.07,26.29 IC4.9 | 55.88,25.24 55.88,26.35 | 55.88,26.35 55.88,28.26 54.93,29.21 54.93,31.43 v55.56,32.07 | C27.1 55.88,25.24
  Bottom 0.508: v74.93,32.07 v67.31,32.07 v55.56,32.07
CON1
  Top 0.254: DA2.13 14.13,20.16 6.83,20.16 6.67,20 5.56,20 | IC3.6 4.76,18.17 4.76,19.21 5.56,19.21 5.56,20 | R44.2 5.56,20
CON2  (via drill 0.35)
  Top 0.254: IC3.2 4.12,11.44 4.29,11.27 v6.03,11.27 5.56,11.27 5.56,10.48 R41.2
  Bottom 0.254: DA2.4 13.81,12.86 7.46,12.86 6.03,11.43 v6.03,11.27
CON3  (via drill 0.35)
  Top 0.254: R43.2 v29.53,19.37 v29.54,19.36 IC5.6
  Bottom 0.254: DA2.12 19.37,17.46 27.62,17.46 v29.53,19.37
CON4  (via drill 0.33)
  Top 0.254: R42.2 v29.21,10.64 29.18,10.67 29.21,10.7 29.21,11.27 28.89,11.6 IC5.2
  Bottom 0.254: DA2.5 19.21,10 28.57,10 v29.21,10.64
CON5  (via drill 0.33)
  Top 0.254: v56.04,19.05 56.05,19.04 55.91,18.89 IC2.2 | R48.2 v53.39,19.53
  Bottom 0.254: DA3.13 64.45,17.46 57.31,17.46 56.04,18.73 v56.04,19.05 55.56,19.53 v53.39,19.53
CON6  (via drill 0.33)
  Top 0.254: R45.2 v55.88,11.43 55.91,11.46 IC2.13
  Bottom 0.254: DA3.4 64.45,13.02 57.47,13.02 v55.88,11.43
CON_O1  (via drill 0.33)
  Top 0.254: IC2.6 53.34,18.09 53.34,18.73 53.02,19.05 v52.7,19.05 52.39,19.05 51.75,18.41 51.75,17.14 51.12,16.51 R52.2
  Bottom 0.254: DA1.12 44.45,17.78 51.44,17.78 v52.7,19.05
CV1  (via drill 0.33, 0.35)
  Top 0.254: R11.1 12.7,13.34 v11.43,12.06 | v12.38,6.67 13.02,6.03 16.19,6.03 SV33.8
  Bottom 0.254: v11.43,12.06 11.43,7.62 v12.38,6.67
CV2
  Top 0.254: R2.1 12.7,7.62 13.49,6.83 19.21,6.83 21.59,4.45 SV1.1
CV2_IN
  Top 0.254: R2.2 12.7,10.16 | 12.7,10.16 DA2.3 | R3.2 11.43,10.16 12.7,10.16
CV3
  Top 0.254: R8.1 20.32,13.49 19.05,12.22 19.05,8.26 21.75,5.56 22.86,5.56 24.13,4.29 SV1.2
CV4
  Top 0.254: R5.1 20.32,7.94 21.91,6.35 24.29,6.35 26.67,3.97 SV1.3
CV5  (via drill 0.33)
  Top 0.254: R23.1 63.5,13.34 v62.23,12.06 | SV3.3 64.45,6.03 62.87,6.03 v62.23,6.67
  Bottom 0.254: v62.23,6.67 v62.23,12.06
CV6
  Top 0.254: R14.1 63.5,7.75 64.29,6.96 66.06,6.96 SV3.4
CV6_IN
  Top 0.254: R14.2 63.5,10.16 | 63.5,10.16 DA3.3 | R15.2 62.23,10.16 63.5,10.16
CV7
  Top 0.254: SV3.5 69.85,5.71 69.85,13.47 R20.1
CV8
  Top 0.254: R17.1 71.12,6.99 SV3.6
CV_A_DRY
  Top 0.254: R35.1 38.1,13.34 36.83,12.06 36.83,7.94 37.94,6.83 37.94,4.6 SV1.8
CV_A_WET
  Top 0.254: SV4.4 47.47,5.24 46.51,5.24 44.45,7.3 44.45,14.42 R32.1
CV_B_DRY
  Top 0.254: R26.1 39.37,5.71 SV4.1
CV_B_WET
  Top 0.254: R29.1 45.24,7.78 46.99,6.03 48.9,6.03 51.75,3.17 SV4.5
CV_O2
  Top 0.254: R27.2 38.1,10.18 | 38.1,10.18 DA1.3 | R26.2 39.37,10.18 38.1,10.18
DGND  (via drill 0.33)
  Top 0.254: IC1.21 33.66,26.38 v33.66,25.42 32.94,24.7 30.26,24.7 29.21,23.65 25.08,23.65 24.77,23.97 24.13,23.97 | v38.89,21.75 38.82,21.67 IC1.12 | v30.96,26.67 26.19,26.67 26.19,25.88 | C23.1 26.19,25.88 | 0.95,24.13 2.7,25.88 7.62,25.88 | 0.95,24.13 0.33,23.5 0.33,5.07 v0.64,4.76 | 24.13,23.97 17.62,23.97 | 17.62,23.97 13.65,23.97 | 13.65,23.97 6.67,23.97 | 6.67,23.97 3.33,23.97 2.22,22.86 2.22,6.35 3.49,5.08 7.3,5.08 8.89,3.49 SV33.4 | 7.62,25.88 12.7,25.88 | 12.7,25.88 17.62,25.88 | 17.62,25.88 24.13,25.88 | 24.13,25.88 26.19,25.88 | IC1.2 32.32,19.93 32.07,19.68 31.27,19.68 31.11,19.84 v31.11,20.32 | v7.62,26.35 7.62,25.88 | v12.7,26.35 12.7,25.88 | v13.65,23.81 13.65,23.97 | v6.67,23.81 6.67,23.97 | v0.64,24.61 0.95,24.29 0.95,24.13 | v17.62,26.35 17.62,25.88 | v24.13,26.35 24.13,25.88 | v24.13,23.81 24.13,23.97 | v17.62,23.81 17.62,23.97
  Bottom 0.254: v33.66,25.42 33.66,23.65 | 33.66,23.65 33.66,21.43 | v38.89,21.75 38.58,21.43 33.66,21.43 | v30.96,26.67 30.96,24.45 31.75,23.65 33.66,23.65 | v2.41,6.22 2.1,6.22 v0.64,4.76 | 33.66,21.43 32.23,21.43 v31.11,20.32
  pour Bottom: 30.48,26.67 30.64,26.83 39.05,26.83 40.32,25.56 40.32,21.59 38.89,20.16 31.11,20.16 30.48,20.8
  pour Bottom: 8.57,3.97 4.6,7.94 4.13,7.94 2.7,9.37 2.7,10.16 2.7,20.48 4.13,21.91 4.13,26.35 3.97,26.51 -0.16,26.51 -0.16,-0.48 8.89,-0.48 8.89,3.65
  pour Bottom: 6.03,26.51 5.87,26.35 5.87,22.07 6.03,21.91 14.29,21.91 14.45,22.07 14.45,26.35 14.29,26.51
  pour Bottom: 16.03,26.35 16.03,22.07 16.19,21.91 17.14,20.95 24.13,20.95 24.61,21.43 24.61,26.35 24.45,26.51 16.19,26.51
DIG_1_BUS_A  (via drill 0.33)
  Top 0.254: IC1.4 33.66,20.61 33.66,21.59 33.34,21.91 31.27,21.91 30.16,20.8 19.37,20.8 17.62,22.54 3.17,22.54 v3.02,22.7 | IC8.1 v1.27,26.35
  Bottom 0.254: v1.27,26.35 1.27,24.45 v3.02,22.7
DIG_1_BUS_B  (via drill 0.33)
  Top 0.254: IC1.5 34.27,21.77 33.66,22.38 31.11,22.38 30,21.27 20,21.27 18.1,23.18 v3.49,23.18 | IC8.16 1.27,29.69 2.54,28.42 v2.54,26.35
  Bottom 0.254: v3.49,23.18 2.54,24.13 v2.54,26.35
DIG_2_BUS_A  (via drill 0.33)
  Top 0.254: IC1.6 34.92,22.39 34.45,22.86 30.96,22.86 29.84,21.75 20.64,21.75 v19.05,23.34 | v19.05,26.51 IC8.8
  Bottom 0.254: v19.05,23.34 v19.05,26.51
DIG_2_BUS_B  (via drill 0.33)
  Top 0.254: IC1.7 35.57,22.54 34.77,23.34 30.8,23.34 29.69,22.23 21.43,22.23 v20.32,23.34 | v20.32,26.51 20.32,34.29 IC8.9
  Bottom 0.254: v20.32,23.34 v20.32,26.51
DIG_3_BUS_A  (via drill 0.33)
  Top 0.254: IC1.17 36.22,24.95 35.08,23.81 30.64,23.81 29.53,22.7 22.23,22.7 v21.59,23.34 | v21.59,26.51 IC9.1
  Bottom 0.254: v21.59,23.34 v21.59,26.51
DIG_3_BUS_B  (via drill 0.33)
  Top 0.254: IC1.18 35.57,24.93 34.92,24.29 30.48,24.29 29.37,23.18 23.02,23.18 v22.86,23.34 | IC9.16 21.59,29.53 22.86,28.26 v22.86,26.51
  Bottom 0.254: v22.86,23.34 v22.86,26.51
DIG_4_BUS_A  (via drill 0.33)
  Top 0.254: IC1.19 34.92,25.4 v34.9,25.4
  Bottom 0.254: v34.9,25.4 36.02,25.4 38.56,27.94 IC9.8
DIG_4_BUS_B  (via drill 0.33)
  Top 0.254: IC1.20 34.29,26.39 v34.29,25.4 | v40.16,26.99 40.48,27.3 40.48,28.89 39.37,30 IC9.9
  Bottom 0.254: v34.29,25.4 34.29,25.08 34.61,24.77 36.04,24.77 38.1,26.83 40.01,26.83 v40.16,26.99
DIG_5_BUS_A  (via drill 0.33)
  Top 0.254: IC1.15 37.52,24.87 v37.62,24.77
  Bottom 0.254: v37.62,24.77 38.73,25.88 40.64,25.88 41.91,27.15 IC10.1
DIG_5_BUS_B  (via drill 0.33)
  Top 0.254: IC1.16 36.87,24.8 v36.83,24.77 | IC10.16 41.91,29.53 v41.12,28.73
  Bottom 0.254: v41.12,28.73 40.8,28.42 40.8,26.83 40.32,26.35 38.42,26.35 v36.83,24.77
DIG_6_BUS_A  (via drill 0.33)
  Top 0.254: IC1.13 38.82,25.48 v39.05,25.24 | v59.05,25.56 59.69,26.19 IC10.8
  Bottom 0.254: v39.05,25.24 39.21,25.08 54.13,25.08 54.45,25.4 58.9,25.4 v59.05,25.56
DIG_6_BUS_B  (via drill 0.33)
  Top 0.254: IC1.14 38.17,25.17 v38.58,24.77 | v59.53,25.08 60.8,26.35 60.8,34.45 IC10.9
  Bottom 0.254: v38.58,24.77 38.73,24.61 54.29,24.61 54.61,24.92 59.37,24.92 v59.53,25.08
DIG_7_BUS_A  (via drill 0.33)
  Top 0.254: IC1.8 36.2,20.6 36.2,22.86 v36.99,23.65 | v60.01,24.61 62.23,26.83 IC11.1
  Bottom 0.254: v36.99,23.65 37.47,24.13 54.61,24.13 54.93,24.45 59.85,24.45 v60.01,24.61
DIG_7_BUS_B  (via drill 0.33)
  Top 0.254: IC1.9 36.83,20.61 36.83,22.54 v37.47,23.18 | v60.48,24.13 63.5,27.15 63.5,28.26 62.23,29.53 IC11.16
  Bottom 0.254: v60.48,24.13 60.33,23.97 55.09,23.97 54.77,23.65 37.94,23.65 v37.47,23.18
DIG_8_BUS_A  (via drill 0.33)
  Top 0.254: IC1.10 37.52,22.28 v37.94,22.7 | v77.79,24.92 80.01,27.15 IC11.8
  Bottom 0.254: v77.79,24.92 76.36,23.5 55.24,23.5 54.93,23.18 38.42,23.18 v37.94,22.7
DIG_8_BUS_B  (via drill 0.33)
  Top 0.254: IC1.11 38.17,21.98 v38.42,22.23 | v77.85,23.97 77.22,24.61 77.22,25.4 78.8,26.99 78.8,28.42 80.01,29.62 IC11.9
  Bottom 0.254: v77.85,23.97 76.9,23.02 55.31,23.02 54.99,22.7 38.89,22.7 v38.42,22.23
GND  (via drill 0.33)
  Top 0.254: R6.1 v21.59,7.62 | R30.1 v46.35,7.62 | IC4.12 50.15,26.97 v50.8,27.62 51.45,26.97 IC4.10 | IC4.3 50.15,19.99 v49.53,19.37 | IC4.5 51.45,20.15 v52.07,19.53
  Top 0.508: C2.2 24.77,13.65 25.4,13.02 DA2.8 | DA3.8 76.2,13.02 75.55,13.66 75.55,14.58 C4.2 | C6.2 49.85,13.65 50.8,12.7 DA1.8
  Bottom 0.61: 24.77,14.92 6.03,14.92
  other vias: 3.97,29.69 3.81,33.97 12.22,32.7 12.22,31.43 12.22,30.16 19.05,32.7 19.05,31.43 19.05,30.16 22.23,32.7 22.23,31.43 22.23,30.16 26.04,32.7 26.04,31.43 26.04,30.16 29.21,32.7 29.21,31.43 29.21,30.16 33.97,32.7 33.02,28.57 27.94,28.57 12.7,28.57 7.78,29.53 51.28,32.7 51.28,31.43 51.28,30.16 48.26,28.57 59.69,32.7 59.69,31.43 59.69,30.16 66.67,32.7 67.94,30.16 68.1,32.7 71.91,30.16 71.91,31.43 71.91,32.7 79.38,32.86 80.64,32.86 80.64,30.32 79.38,30.32 76.2,22.07 74.14,24.61 67.79,25.08 67.31,20.32 72.23,21.43 63.18,25.08 62.39,20.95 59.53,20.95 3.97,15.72 12.06,7.78 19.05,4.6 16.51,4.6 25.4,4.29 26.51,5.24 33.02,0.64 22.86,3.81 29.37,7.14 42.86,4.76 48.74,5.08 76.2,5.71 80.01,23.97 35.56,30.16 35.56,28.57 76.99,26.35 77.15,29.05 54.61,15.24 58.26,15.24 58.42,5.87 61.28,5.87 64.45,4.6 13.81,14.92 16.51,14.92 19.05,14.92 21.59,12.54 16.51,12.54 34.29,15.88 40.64,13.02 39.53,14.61 47.78,13.02 42.86,13.02 64.77,10.48 67.31,13.02 67.31,15.24 70.48,10.16 73.03,10.32 30,15.24 8.1,15.4 6.19,9.84 6.51,17.94 10.79,17.46 10.79,10.32 21.59,19.05 19.05,19.05 24.13,19.05 31.11,10.64 35.56,4.45 53.34,3.81 48.26,0.64 66.36,5.08 13.81,4.76 56.52,21.27
  pour Bottom: -0.32,36.99 81.76,36.99 81.76,-0.48 12.7,-0.48 12.7,3.81 11.43,5.08 9.21,5.08 4.92,9.37 4.29,9.37 3.49,10.16 3.49,20 4.6,21.11 16.03,21.11 16.99,20.16 30,20.16 31.27,18.89 38.73,18.89 41.75,21.91 60.96,21.91 61.44,22.38 61.44,24.29 59.37,26.35 58.1,26.35 57.63,25.88 43.5,25.88 43.02,26.35 43.02,28.42 37.94,28.42 37.47,27.94 -0.32,27.94
  pour Top: -0.64,37.31 81.92,37.31 81.92,-0.79 82.07,-0.95 12.7,-0.95 12.7,3.81 11.43,5.08 9.21,5.08 4.92,9.37 4.29,9.37 3.49,10.16 3.49,20 4.6,21.11 16.19,21.11 17.78,19.53 30.64,19.53 31.27,18.89 38.73,18.89 41.75,21.91 41.75,26.83 40.16,28.42 37.94,28.42 37.47,27.94 -0.48,27.94 -0.48,36.67 -0.64,36.83 -1.27,36.83 -0.64,37.47
IN1  (via drill 0.33, 0.35)
  Top 0.254: R13.1 10.16,13.34 v8.89,12.06 | v9.84,6.03 10.64,6.03 11.91,4.76 12.7,4.76 13.97,3.49 SV33.6
  Bottom 0.254: v8.89,12.06 8.89,6.99 v9.84,6.03
IN2
  Top 0.254: R4.1 10.16,7.62 12.38,5.4 14.29,5.4 SV33.7
IN3  (via drill 0.33)
  Top 0.254: v25.56,8.26 24.13,9.68 24.13,12.38 22.86,13.65 R10.1
  Bottom 0.254: SV1.4 29.21,4.6 v25.56,8.26
IN4
  Top 0.254: R7.1 22.86,7.75 23.47,7.14 27.78,7.14 SV1.5
IN5  (via drill 0.33)
  Top 0.254: R25.1 60.96,13.34 v59.69,12.06 | SV3.1 59.69,5.71 v59.69,6.67
  Bottom 0.254: v59.69,6.67 v59.69,12.06
IN6
  Top 0.254: SV3.2 60.64,7.3 60.64,8.07 R16.1
IN7  (via drill 0.33)
  Top 0.254: v72.39,12.06 73.66,13.34 R22.1 | SV3.7 74.77,5.87 73.98,5.87 v73.18,6.67
  Bottom 0.254: v72.39,12.06 72.39,7.46 v73.18,6.67
IN8
  Top 0.254: R19.1 73.66,7.78 74.3,7.14 76.04,7.14 SV3.8
IN_O1
  Top 0.254: DA1.15 R37.2
IN_O2
  Top 0.254: R28.2 DA1.2
IN_O3
  Top 0.254: R34.2 46.83,17.62 DA1.10
IN_O4
  Top 0.254: R31.2 DA1.7
N$1
  Top 0.254: R39.2 DA3.1
N$2
  Top 0.254: R38.2 DA2.1
N$3
  Top 0.254: R17.2 71.12,10.16 | 71.12,10.16 DA3.6 | R18.2 72.39,10.16 71.12,10.16
N$4  (via drill 0.33)
  Top 0.254: v79.69,13.34 IC6.3 79.7,11.44 80.03,11.11 80.33,11.11 80.49,10.95 80.49,10.48 80.33,10.32 R46.1
  Bottom 0.254: DA3.5 70.17,13.02 76.83,13.02 77.63,12.22 78.58,12.22 v79.69,13.34
N$5
  Top 0.254: R20.2 71.12,17.78 | 71.12,17.78 DA3.11 | R21.2 72.39,17.78 71.12,17.78
N$6  (via drill 0.33)
  Top 0.254: R50.2 53.31,9.42 v53.31,11.43 IC2.9
  Bottom 0.254: DA1.5 44.45,10.16 52.04,10.16 v53.31,11.43
N$7
  Top 0.254: R23.2 63.5,17.78 | 63.5,17.78 DA3.14 | R24.2 62.23,17.78 63.5,17.78
N$8
  Top 0.254: R39.1 58.42,7.62 59.69,7.62 C14.2
N$9
  Top 0.254: DA1.1 R40.2
N$10
  Top 0.254: R5.2 20.32,10.16 | 20.32,10.16 DA2.6 | R6.2 21.59,10.16 20.32,10.16
N$11
  Top 0.254: R29.2 45.24,10.16 45.72,10.16 | 45.72,10.16 DA1.6 | R30.2 46.35,10.16 45.72,10.16
N$12
  Top 0.254: R8.2 20.32,17.78 | 20.32,17.78 DA2.11 | R9.2 21.59,17.78 20.32,17.78
N$13
  Top 0.254: R32.2 44.13,17.46 44.45,17.78 45.24,17.78 | DA1.11 45.72,18.1 45.4,17.78 45.24,17.78 | 45.24,17.78 R33.2
N$14
  Top 0.254: R38.1 7.62,7.62 8.89,7.62 C13.2
N$15
  Top 0.254: R35.2 38.1,17.78 | 38.1,17.78 DA1.14 | R36.2 36.83,17.78 38.1,17.78
N$16
  Top 0.254: R40.1 33.02,7.62 34.29,7.62 C15.2
N$17  (via drill 0.33)
  Top 0.254: R51.1 DA1.4 | IC2.10 53.98,12.4 v53.98,11.43
  Bottom 0.254: v53.98,11.43 53.98,11.11 52.39,9.53 43.18,9.53 41.27,11.43 DA1.4
N$18  (via drill 0.33)
  Top 0.254: v53.98,17.14 53.96,17.16 IC2.5 | R49.1 DA1.13
  Bottom 0.254: DA1.13 42.55,17.14 v53.98,17.14
N$19  (via drill 0.33)
  Top 0.254: IC6.5 80.33,18.19 80.33,20.32 | 80.33,20.32 R47.1 | DA3.12 69.85,20.32 v75.72,20.32 | v77.15,21.27 80.01,21.27 80.33,20.95 80.33,20.32
  Bottom 0.254: v77.15,21.27 76.2,20.32 v75.72,20.32
N$21
  Top 0.254: R11.2 12.7,17.78 | 12.7,17.78 DA2.14 | R12.2 11.43,17.78 12.7,17.78
OUT1  (via drill 0.33)
  Top 0.254: IC3.7 4.13,18.17 v4.13,19.21 3.33,19.21 3.33,20 R44.1 | R59.1 5.08,30.8 | R60.1 5.08,32.7 5.08,30.8 | 5.08,30.8 v5.08,27.3
  Bottom 0.254: v5.08,27.3 5.08,20.16 v4.13,19.21
OUT2  (via drill 0.33)
  Top 0.254: R54.1 15.24,32.7 15.24,30.8 | 15.24,30.8 R53.1 | v15.24,20.64 v6.19,20.64 | v15.24,27.3 15.24,30.8 | R41.1 3.33,10.48 3.33,11.27 3.47,11.41 IC3.1 3.47,14.11 v5.24,15.88
  Bottom 0.254: v6.19,20.64 6.19,20 5.4,19.21 5.4,16.03 v5.24,15.88 | v15.24,20.64 v15.24,27.3
OUT3  (via drill 0.33)
  Top 0.254: R58.1 25.4,32.7 25.4,30.8 | 25.4,30.8 R57.1 | v25.4,27.3 25.4,30.8 | R43.1 26.99,19.37 v26.99,18.57 27.3,18.26 27.3,16.19 27.78,15.72 28.26,15.72 28.89,16.35 IC5.7
  Bottom 0.254: v26.99,18.57 26.99,19.37 25.4,20.95 v25.4,27.3
OUT4  (via drill 0.33)
  Top 0.254: R55.1 35.56,30.8 35.56,31.43 | R56.1 35.56,32.7 35.56,31.43 | v30.48,16.51 30,16.51 27.26,13.77 27.26,13.34 | v30.48,27.46 30.48,28.26 31.75,29.53 33.66,29.53 33.97,29.84 33.97,31.43 35.56,31.43 | R42.1 26.83,10.64 26.83,11.43 27.26,11.86 27.26,13.34 | IC5.1 28.23,13.04 27.94,13.34 27.26,13.34
  Bottom 0.254: v30.48,27.46 29.84,26.83 29.84,20.64 30.48,20 v30.48,16.51
OUT5  (via drill 0.33)
  Top 0.254: R68.1 43.18,32.7 43.18,30.8 | R67.1 43.18,30.8 | 43.18,30.8 v43.18,21.91 | IC2.1 56.56,19.64 v56.2,20 55.72,19.53 R48.1
  Bottom 0.254: v43.18,21.91 54.29,21.91 v56.2,20
OUT6  (via drill 0.33)
  Top 0.254: R61.1 58.76,30.8 | R62.1 58.74,32.7 58.76,32.68 58.76,30.8 | 58.76,30.8 58.76,29.23 58.42,28.89 58.42,25.24 58.74,24.92 58.74,21.11 57.15,19.53 57.15,15.72 56.56,15.13 IC2.14 56.56,10.52 v56.52,10.48 | v55.88,7.62 R45.1
  Bottom 0.254: v56.52,10.48 56.52,8.26 v55.88,7.62
OUT7
  Top 0.254: R65.1 66.04,30.8 66.04,31.43 | 66.04,31.43 66.04,32.7 R66.1 | 66.04,31.43 67.63,31.43 68.58,30.48 68.58,27.46 74.77,21.27 75.88,21.27 77.95,19.21 79.06,19.21 | 79.06,19.21 79.53,19.21 79.7,19.04 IC6.6 | 79.06,19.21 79.06,18.17 IC6.7
OUT8  (via drill 0.33)
  Top 0.254: R63.1 76.2,30.8 | 76.2,30.8 76.2,32.7 R64.1 | 76.2,30.8 76.2,24.45 78.58,22.07 v80.33,22.07 | IC6.1 78.4,13.31 v78.42,13.34 78.58,13.49 78.9,13.49 79.06,13.34 IC6.2
  Bottom 0.254: v80.33,22.07 80.33,15.88 78.42,13.97 v78.42,13.34
OUT_A  (via drill 0.33)
  Top 0.254: SV4.2 43.97,3.65 v43.97,6.67 | v51.12,6.67 52.07,7.62 52.07,13.97 | IC2.7 52.66,15.51 52.07,14.92 52.07,13.97 | R52.1 51.12,14.29 51.44,13.97 52.07,13.97
  Bottom 0.254: v51.12,6.67 v43.97,6.67
OUT_B  (via drill 0.33)
  Top 0.254: SV4.3 46.99,3.81 v45.09,5.71 | IC2.8 52.66,7.3 | 52.66,7.3 52.66,6.62 v51.75,5.71 | R50.1 53.34,7.62 53.02,7.3 52.66,7.3
  Bottom 0.254: v45.09,5.71 v51.75,5.71
SCL
  Top 0.254: IC1.22 32.97,25.66 32.38,25.08 30,25.08 29.05,24.13 25.4,24.13 25.08,24.45 3.17,24.45 1.75,23.02 1.75,6.03 3.33,4.45 5.08,4.45 SV33.3
SDA
  Top 0.254: IC1.23 32.32,25.65 32.23,25.56 29.84,25.56 28.89,24.61 25.72,24.61 25.4,24.92 3.02,24.92 1.27,23.18 1.27,5.71 SV33.2
SUM1
  Top 0.254: R13.2 DA2.15
SUM2
  Top 0.254: R4.2 DA2.2
SUM3
  Top 0.254: R10.2 DA2.10
SUM4
  Top 0.254: R7.2 DA2.7
SUM5
  Top 0.254: R25.2 DA3.15
SUM6
  Top 0.254: R16.2 DA3.2
SUM7
  Top 0.254: R22.2 DA3.10
SUM8
  Top 0.254: R19.2 DA3.7
SUM_A  (via drill 0.33)
  Top 0.254: 48.26,20.64 48.82,20.64 IC4.1 | 48.26,20.64 v48.26,20.8 48.26,21.75 C24.2 | 48.26,20.64 R79.2 | v34.29,15.24 34.29,13.97 | 34.29,13.97 35.56,13.97 R37.1 | v42.07,20.8 40.64,20.8 39.37,19.53 v39.37,15.24 | SV1.6 v34.29,5.08 | v34.29,12.06 34.29,13.97
  Bottom 0.254: v42.07,20.8 v48.26,20.8 | v39.37,15.24 v34.29,15.24 | v34.29,5.08 v34.29,12.06
SUM_B  (via drill 0.33)
  Top 0.254: 48.26,26.35 R80.2 | 48.26,26.35 48.82,26.35 IC4.14 | 48.26,26.35 v48.26,26.99 | R28.1 v35.56,7.62 36.83,6.35 SV1.7 | v43.81,26.04 43.81,21.59 41.91,19.68 v41.91,9.68 | C25.2 48.26,25.24 48.26,26.35
  Bottom 0.254: v48.26,26.99 47.62,26.35 44.13,26.35 v43.81,26.04 | v41.91,9.68 41.12,8.89 36.83,8.89 v35.56,7.62
SUM_FX_A  (via drill 0.33)
  Top 0.254: IC4.7 52.78,20.64 v53.34,20.64 | v53.34,20.64 R81.2 | v46.99,19.68 46.99,18.53 46.04,17.57 46.04,14.29 46.35,13.97 46.67,13.97 46.83,14.13 R34.1 | v53.34,20.64 53.34,21.75 C26.2
  Bottom 0.254: v46.99,19.68 47.47,20.16 52.86,20.16 v53.34,20.64
SUM_FX_B  (via drill 0.33)
  Top 0.254: IC4.8 52.78,26.35 v53.34,26.35 | v53.34,26.35 R82.2 | v43.81,12.86 43.18,13.49 43.18,17.3 44.45,18.57 v44.45,25.72 | R31.1 48.26,7.46 47.15,7.46 47.15,10.64 46.99,10.79 v46.99,12.7 | v53.34,26.35 53.34,25.24 C27.2
  Bottom 0.254: v53.34,26.35 48.74,26.35 48.1,25.72 v44.45,25.72 | v46.99,12.7 43.97,12.7 v43.81,12.86
SW1A
  Top 0.254: R59.2 2.38,30.8 2.38,30 3.81,28.57 IC8.2
SW1B
  Top 0.254: IC8.15 2.38,34.13 2.38,32.7 R60.2
SW2A
  Top 0.254: R53.2 17.78,30.8 17.78,29.21 IC8.7
SW2B
  Top 0.254: R54.2 17.78,32.7 17.78,34.29 IC8.10
SW3A
  Top 0.254: R57.2 22.86,30.8 22.86,29.21 IC9.2
SW3B
  Top 0.254: R58.2 22.86,32.7 22.86,34.29 IC9.15
SW4A
  Top 0.254: R55.2 38.1,30.8 38.1,29.21 IC9.7
SW4B
  Top 0.254: R56.2 38.1,32.7 38.1,34.29 IC9.10
SW5A
  Top 0.254: IC10.2 45.72,29.21 45.72,30.8 R67.2
SW5B
  Top 0.254: R68.2 45.72,32.7 45.72,34.29 IC10.15
SW6A
  Top 0.254: IC10.7 57.15,28.89 56.2,29.84 56.2,30.8 R61.2
SW6B
  Top 0.254: R62.2 56.2,32.7 56.2,34.61 IC10.10
SW7A
  Top 0.254: R65.2 63.5,30.8 63.5,29.21 IC11.2
SW7B
  Top 0.254: R66.2 63.5,32.7 63.5,34.29 IC11.15
SW8A
  Top 0.254: R63.2 78.74,30.8 78.74,29.21 IC11.7
SW8B
  Top 0.254: R64.2 78.74,32.7 78.74,34.29 IC11.10
VL
  Top 0.254: IC9.12 31.75,33.02 | 31.75,33.02 R78.1 | 31.75,33.02 32.38,33.02 32.38,30.48 33.02,30.48 R77.2
  Bottom 0.254: IC8.12 11.43,34.29 31.75,34.29 | IC11.12 72.39,34.29 52.07,34.29 | 31.75,34.29 52.07,34.29 | IC10.12 52.07,34.29 | IC9.12 31.75,34.29

### Text on the board
tNames: Pre-filter bus mixer / DG412 version v1.1 | 4VOB
bNames: +3V3 | SDA | SCL | DGND | RST | In 1 | In 2 | CV 1 | CV 2 | CV 3 | CV 4 | In 3 | In 4 | SUM A | SUM B | CV A | CV B | OUT A | OUT B | CV FX A | CV FX B | +12V | AGND | -12V | In 5 | In 6 | CV 5 | CV 6 | CV 7 | CV 8 | In 7 | In 8